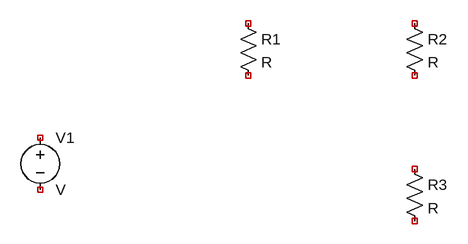
[diagram p0: schematic Draft1.asc]
Draft1.asc, the LTspice schematic file:
Version 4
SHEET 1 880 680
SYMBOL res 208 32 R0
SYMATTR InstName R1
SYMBOL res 464 32 R0
SYMATTR InstName R2
SYMBOL res 464 256 R0
SYMATTR InstName R3
SYMBOL voltage -96 208 R0
SYMATTR InstName V1

The netlist it stands for:
* Draft1.asc
R1 NC_01 NC_02 R
R2 NC_03 NC_04 R
R3 NC_05 NC_06 R
V1 NC_07 NC_08 V
.backanno
.end